# EAGLE schematic custom_ar_glasses_circuit_dlp (EAGLE 9.6.2)
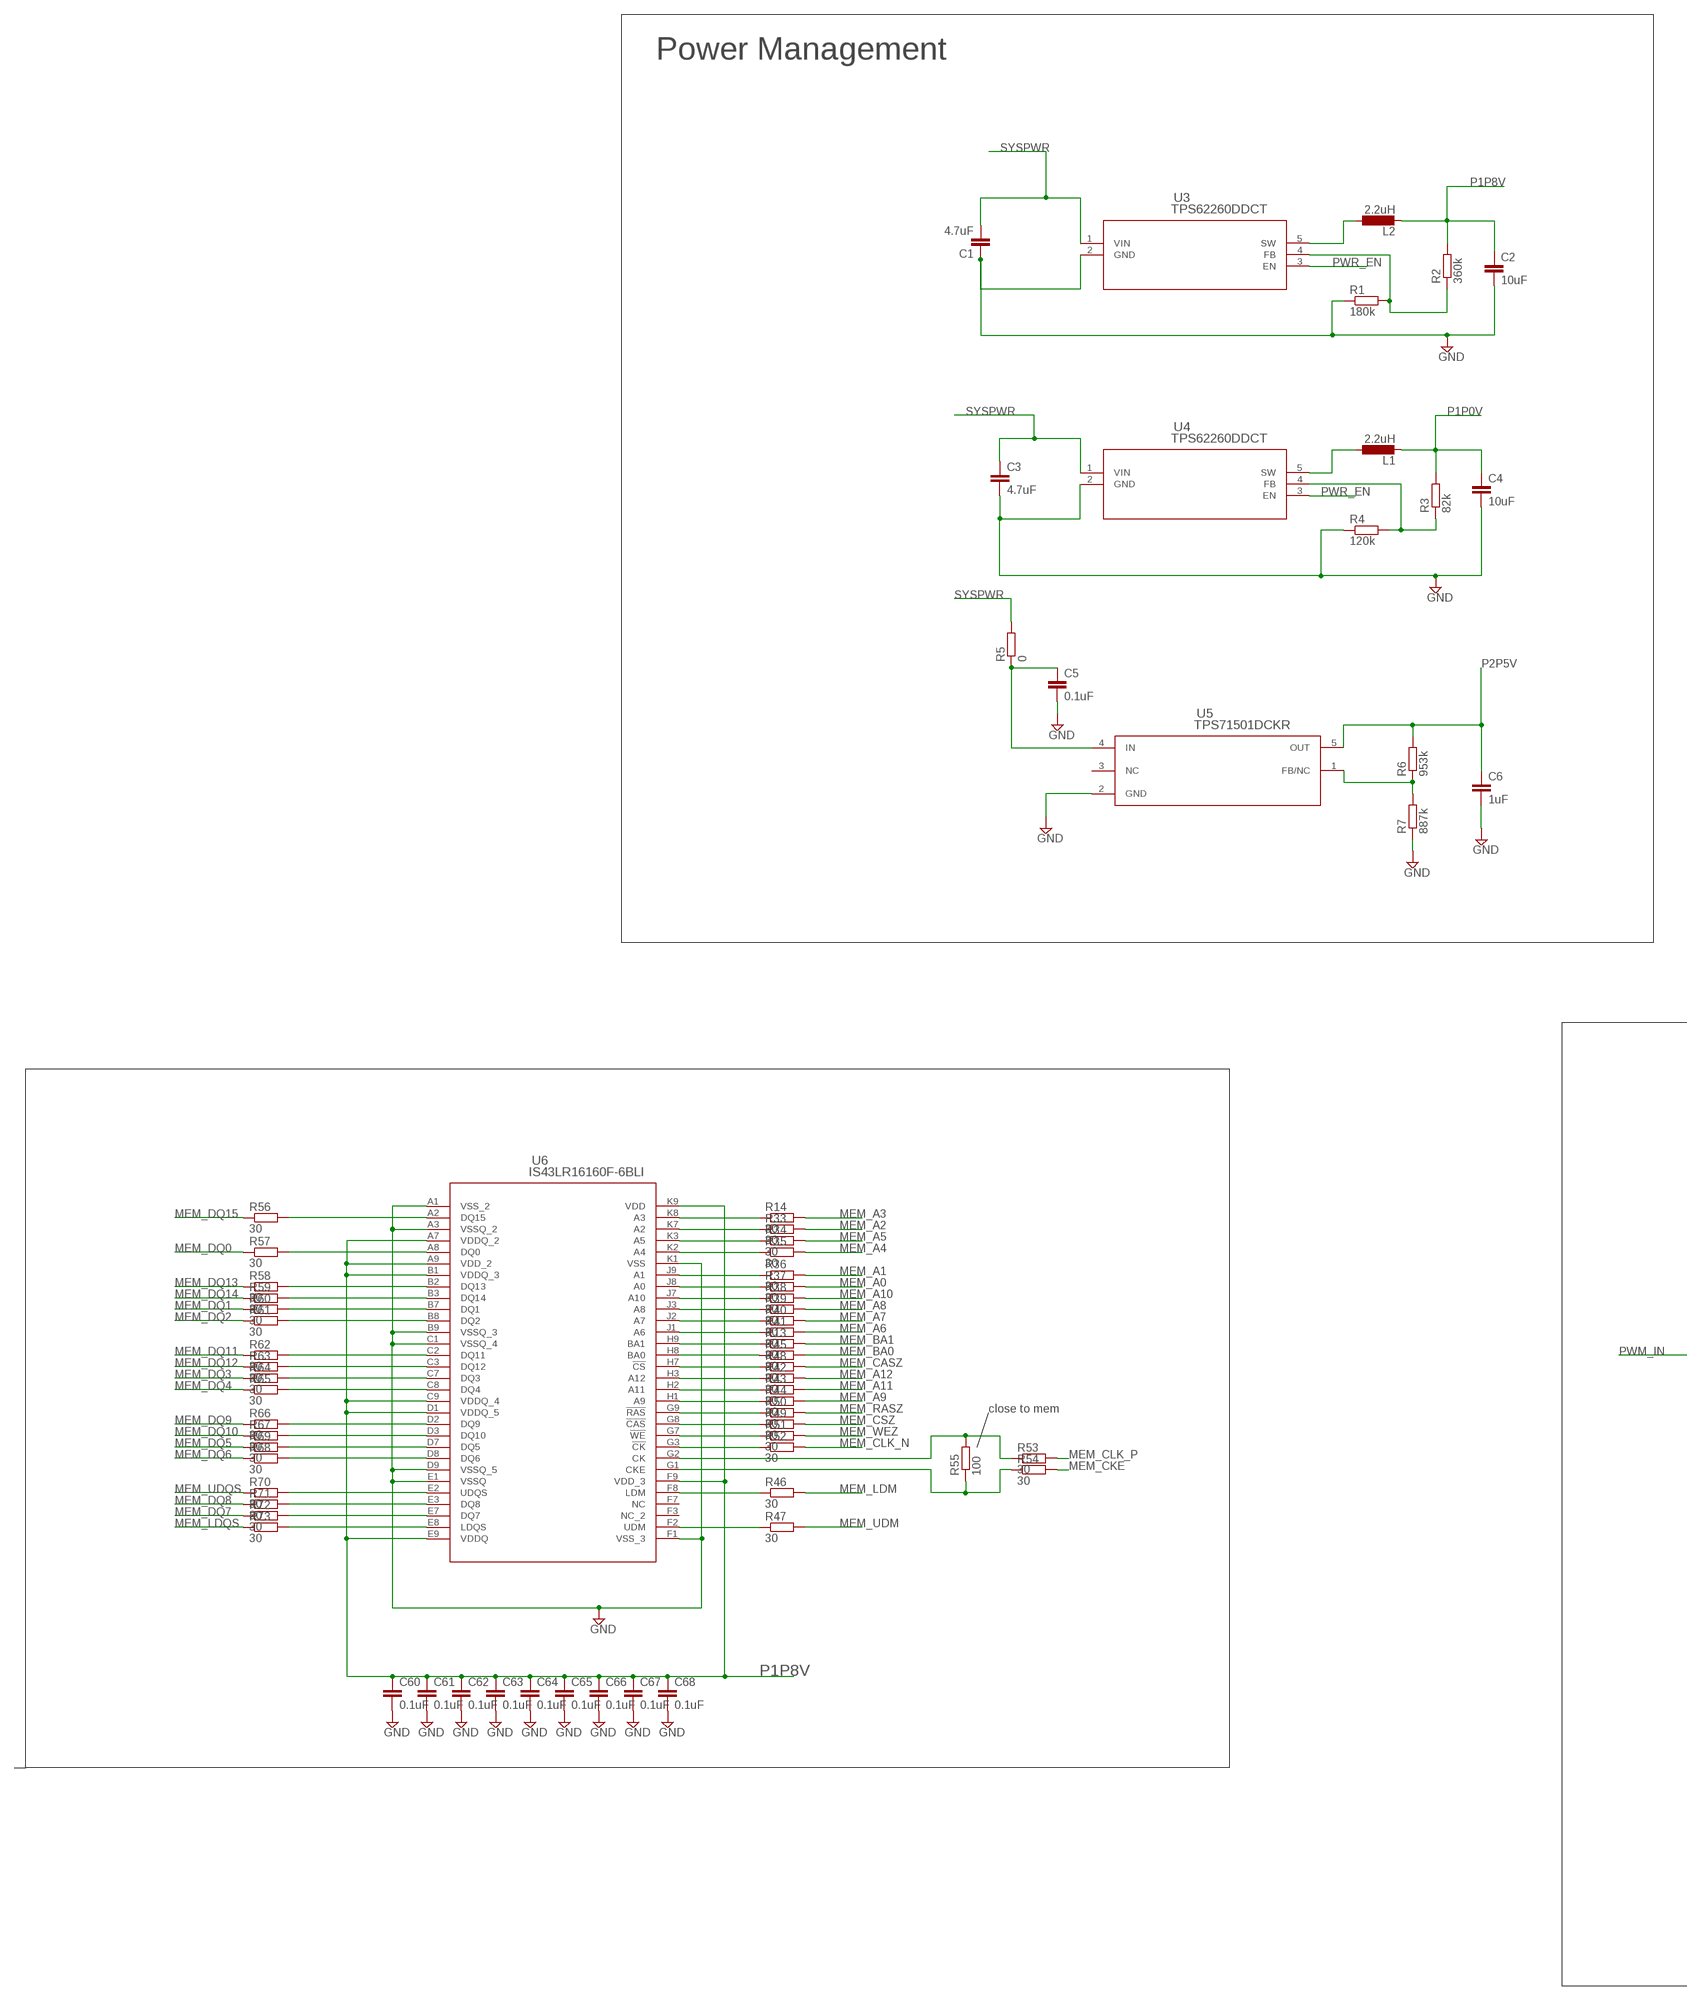
[diagram p0: schematic, sheet 1, part 1 of 3]
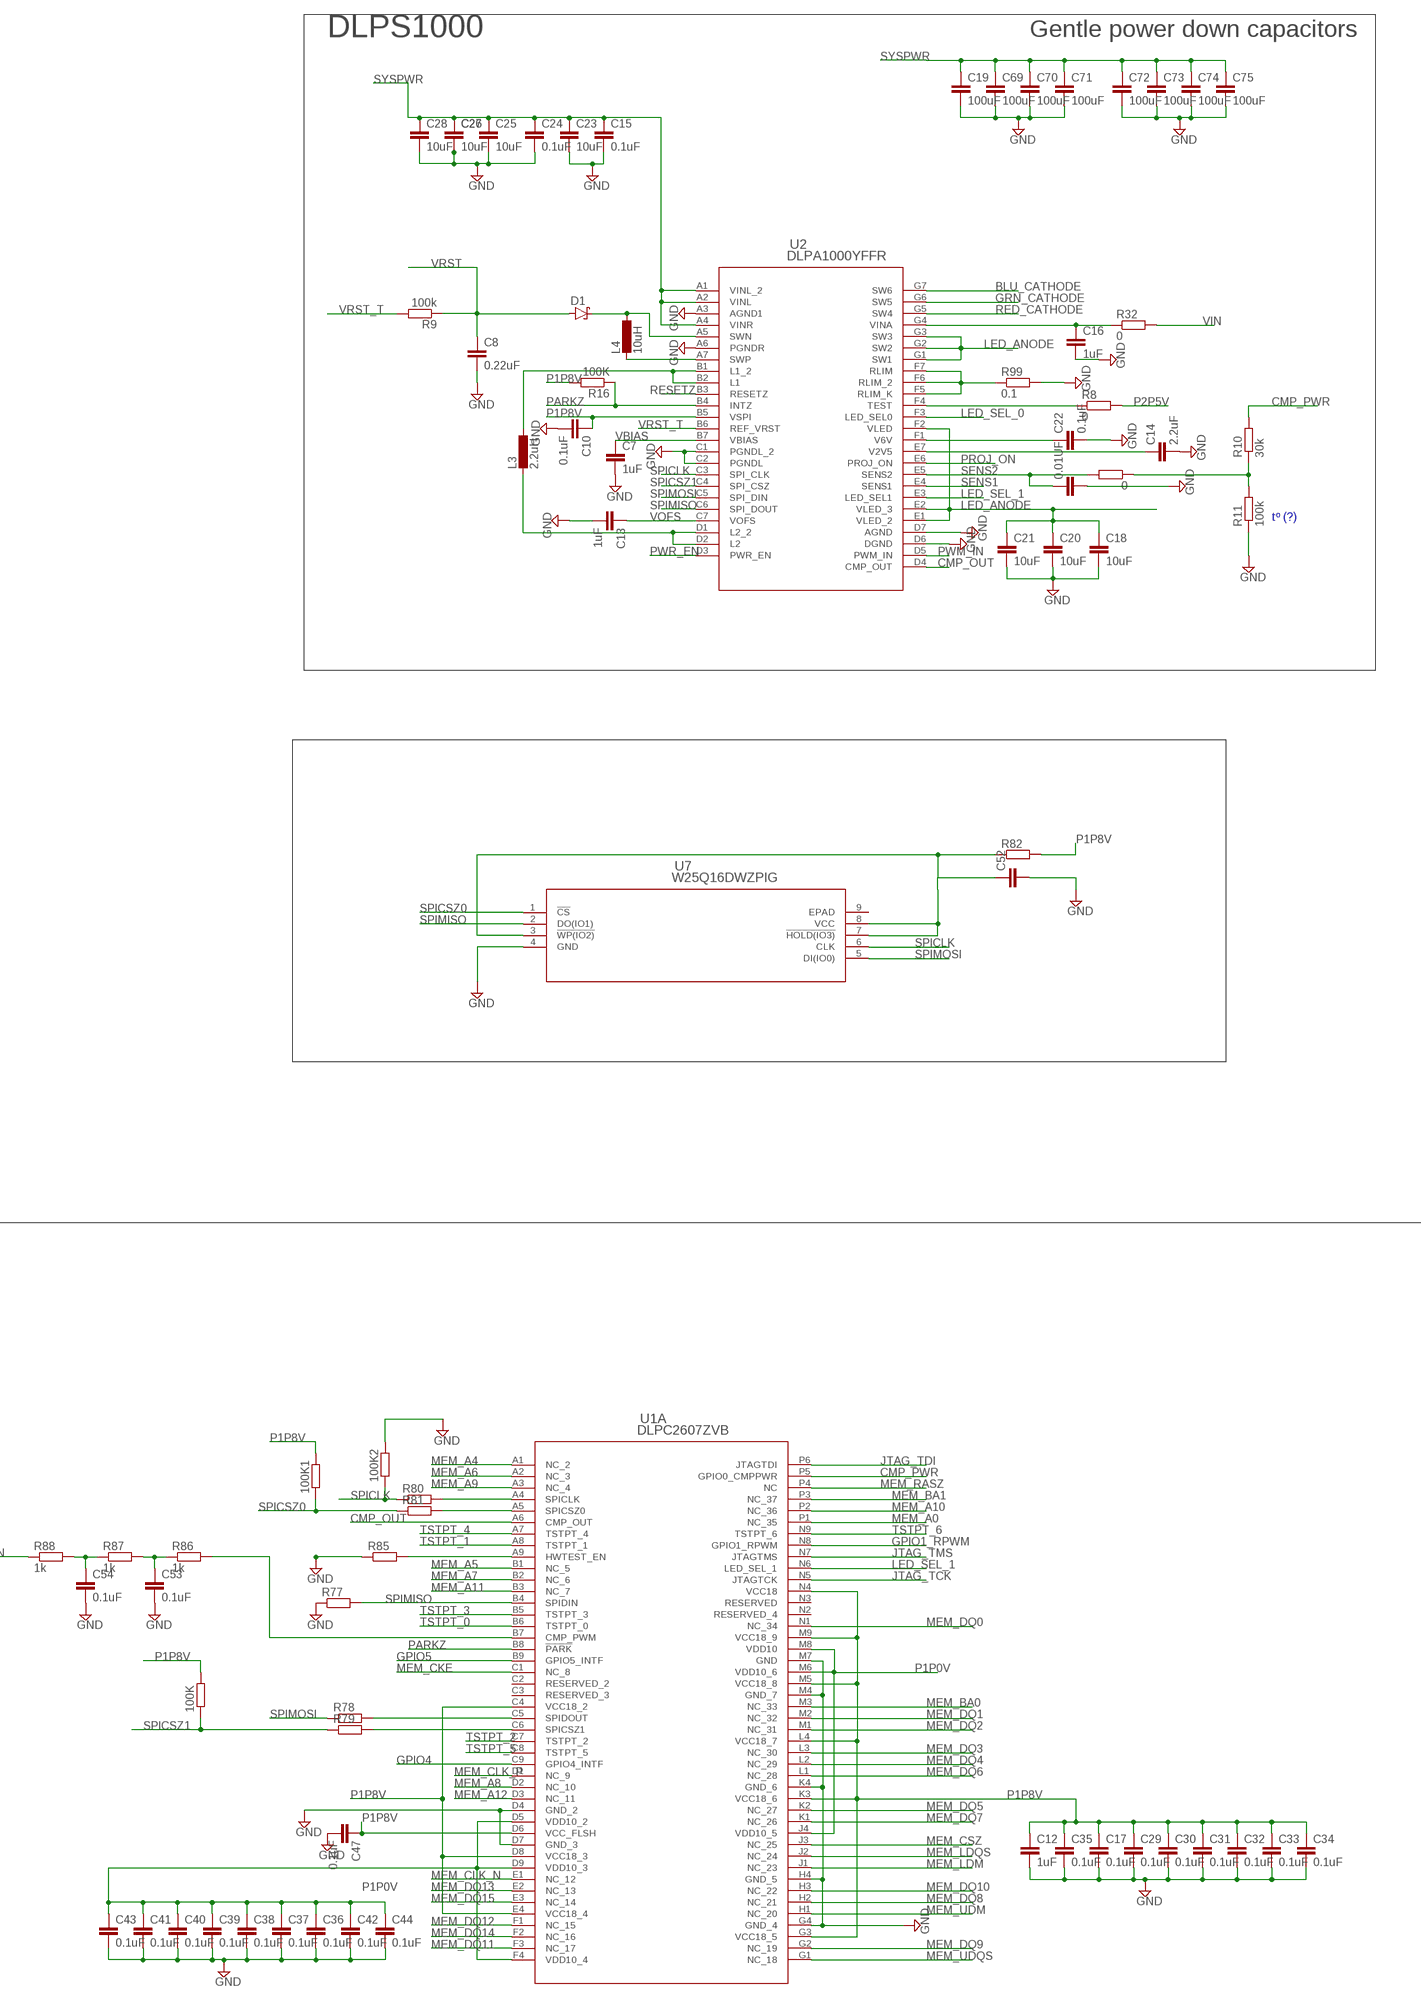
[diagram p1: schematic, sheet 1, part 2 of 3]
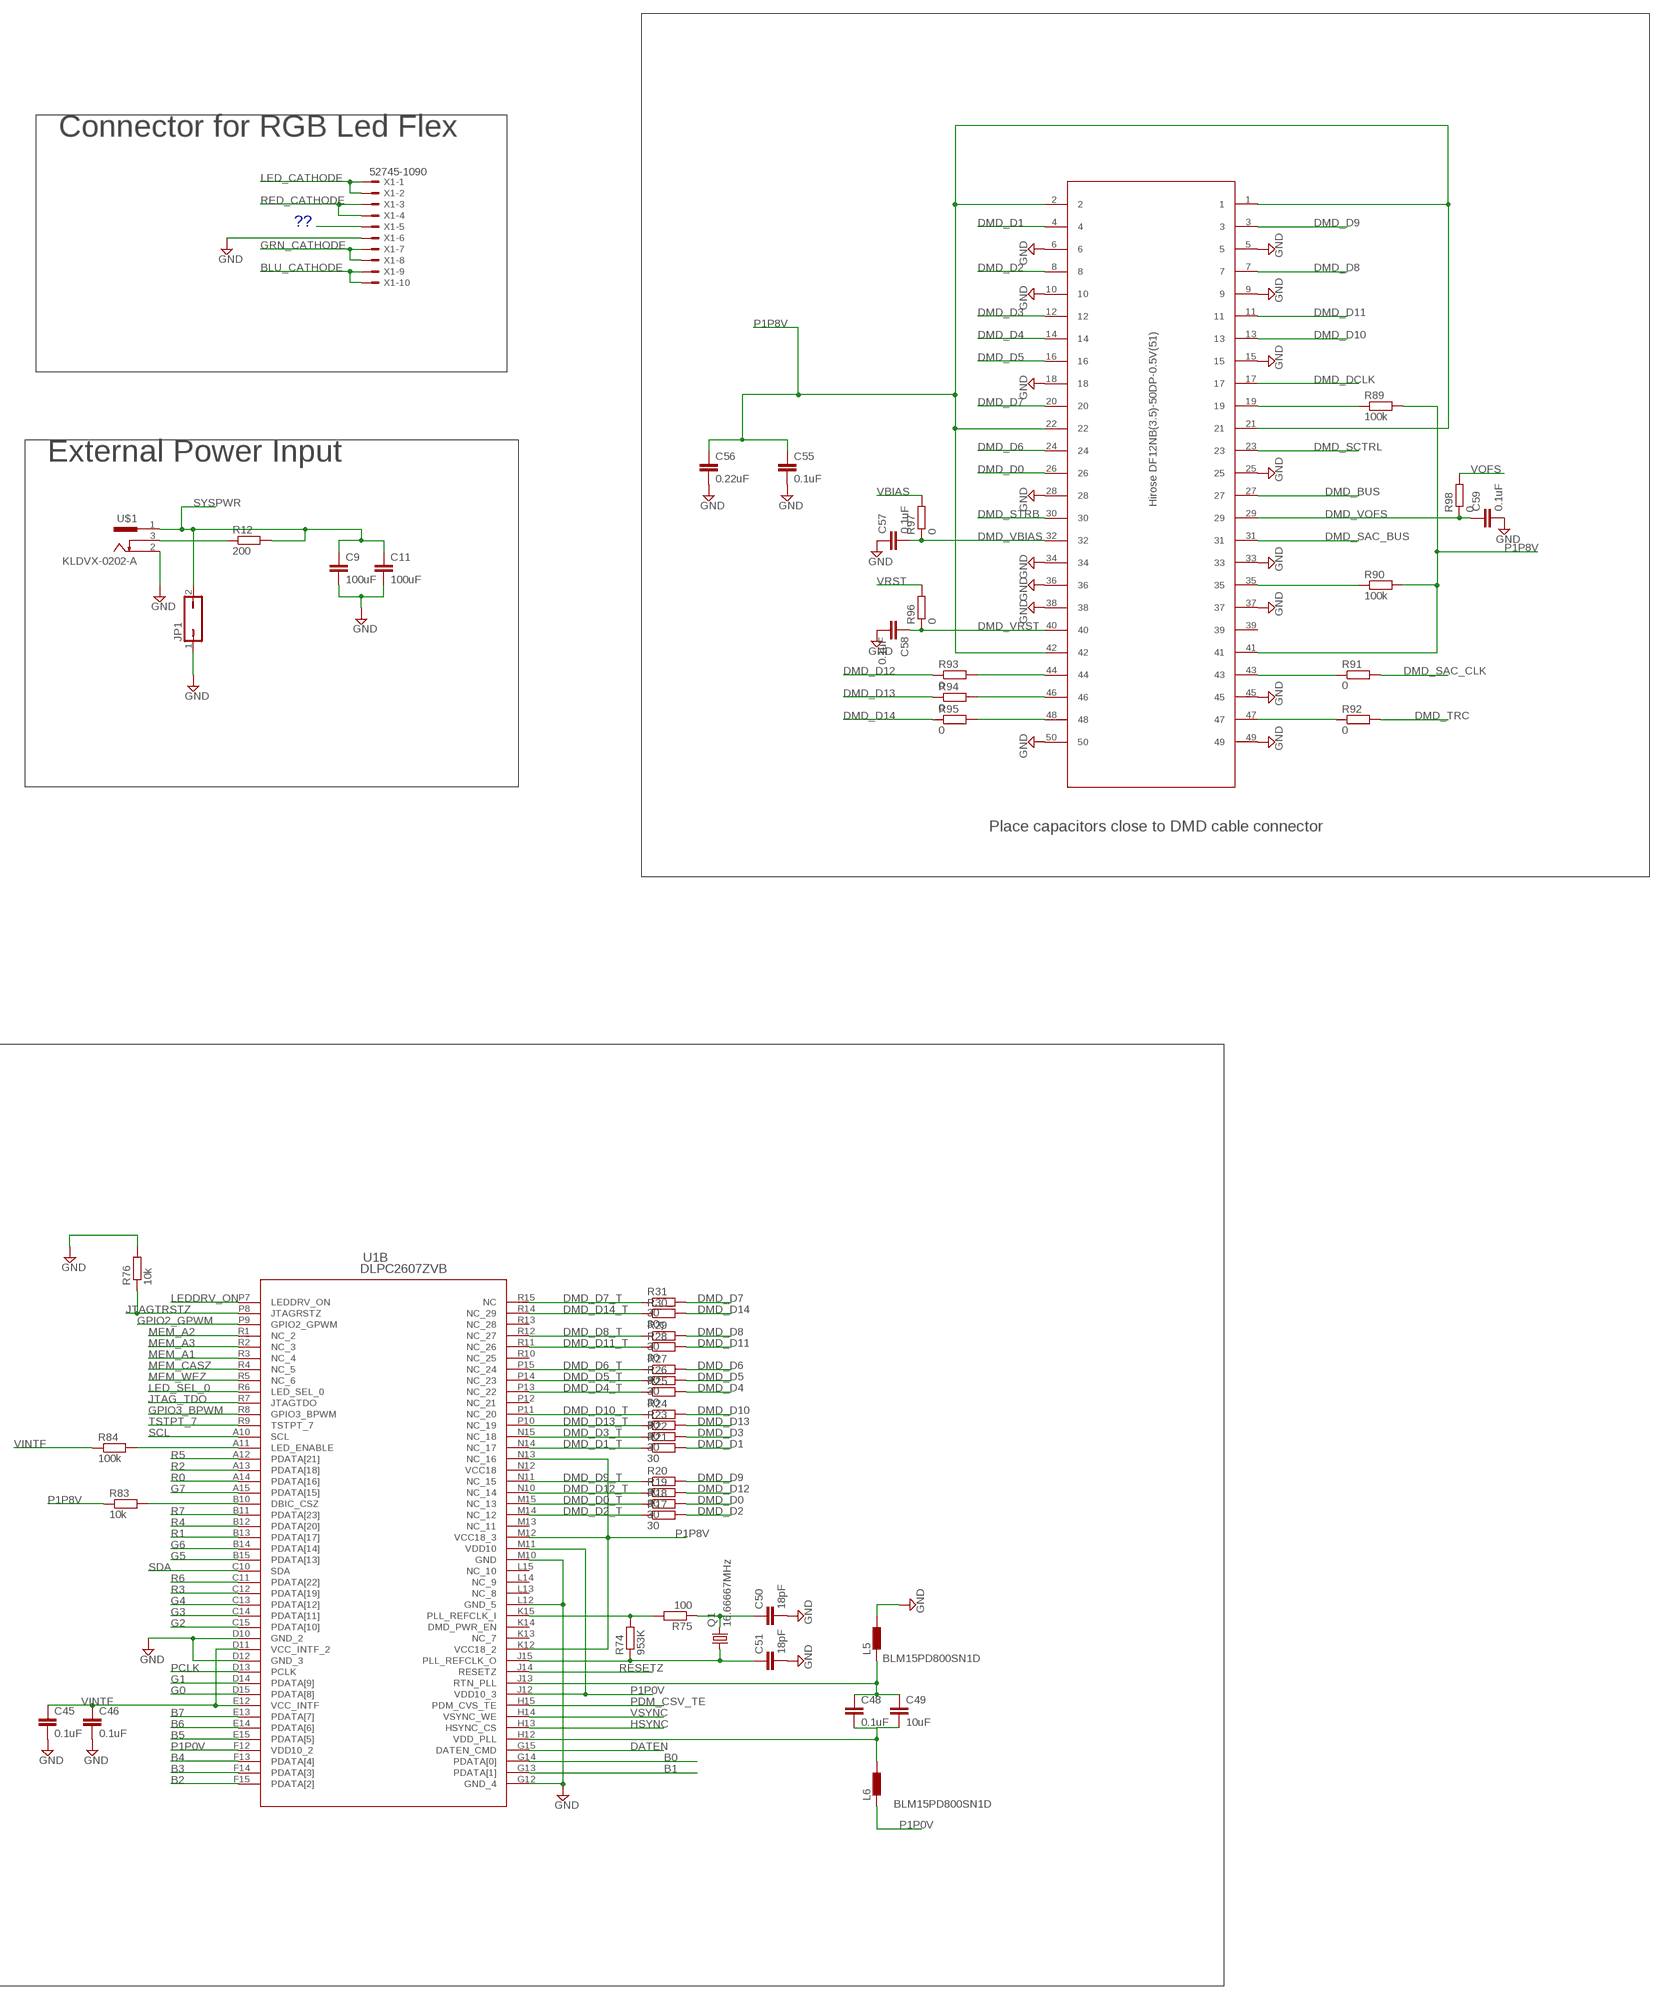
[diagram p2: schematic, sheet 1, part 3 of 3]

## Parts
0  R-EU_R0201  [R0201]
0.01UF  C-EUC0201  [C0201]
100K  R-EU_R0201  [R0201]
100K1  R-EU_R0201  [R0201]
100K2  R-EU_R0201  [R0201]
C1  4.7uF  C-EUC0201  [C0201]
C2  10uF  C-EUC0201  [C0201]
C3  4.7uF  C-EUC0201  [C0201]
C4  10uF  C-EUC0201  [C0201]
C5  0.1uF  C-EUC0201  [C0201]
C6  1uF  C-EUC0201  [C0201]
C7  1uF  C-EUC0201  [C0201]
C8  0.22uF  C-EUC0201  [C0201]
C9  100uF  C-EUC1206K  [C1206K]
C10  0.1uF  C-EUC0201  [C0201]
C11  100uF  C-EUC1206K  [C1206K]
C12  1uF  C-EUC0201  [C0201]
C13  1uF  C-EUC0201  [C0201]
C14  2.2uF  C-EUC0201  [C0201]
C15  0.1uF  C-EUC0201  [C0201]
C16  1uF  C-EUC0201  [C0201]
C17  0.1uF  C-EUC0201  [C0201]
C18  10uF  C-EUC0201  [C0201]
C19  100uF  C-EUC0805  [C0805]
C20  10uF  C-EUC0201  [C0201]
C21  10uF  C-EUC0201  [C0201]
C22  0.1uF  C-EUC0201  [C0201]
C23  10uF  C-EUC0201  [C0201]
C24  0.1uF  C-EUC0201  [C0201]
C25  10uF  C-EUC0201  [C0201]
C26  C-EUC0201  [C0201]
C27  10uF  C-EUC0201  [C0201]
C28  10uF  C-EUC0201  [C0201]
C29  0.1uF  C-EUC0201  [C0201]
C30  0.1uF  C-EUC0201  [C0201]
C31  0.1uF  C-EUC0201  [C0201]
C32  0.1uF  C-EUC0201  [C0201]
C33  0.1uF  C-EUC0201  [C0201]
C34  0.1uF  C-EUC0201  [C0201]
C35  0.1uF  C-EUC0201  [C0201]
C36  0.1uF  C-EUC0201  [C0201]
C37  0.1uF  C-EUC0201  [C0201]
C38  0.1uF  C-EUC0201  [C0201]
C39  0.1uF  C-EUC0201  [C0201]
C40  0.1uF  C-EUC0201  [C0201]
C41  0.1uF  C-EUC0201  [C0201]
C42  0.1uF  C-EUC0201  [C0201]
C43  0.1uF  C-EUC0201  [C0201]
C44  0.1uF  C-EUC0201  [C0201]
C45  0.1uF  C-EUC0201  [C0201]
C46  0.1uF  C-EUC0201  [C0201]
C47  0.1uF  C-EUC0201  [C0201]
C48  0.1uF  C-EUC0201  [C0201]
C49  10uF  C-EUC0201  [C0201]
C50  18pF  C-EUC0201  [C0201]
C51  18pF  C-EUC0201  [C0201]
C52  C-EUC0201  [C0201]
C53  0.1uF  C-EUC0201  [C0201]
C54  0.1uF  C-EUC0201  [C0201]
C55  0.1uF  C-EUC0201  [C0201]
C56  0.22uF  C-EUC0201  [C0201]
C57  0.1uF  C-EUC0201  [C0201]
C58  0.1uF  C-EUC0201  [C0201]
C59  0.1uF  C-EUC0201  [C0201]
C60  0.1uF  C-EUC0201  [C0201]
C61  0.1uF  C-EUC0201  [C0201]
C62  0.1uF  C-EUC0201  [C0201]
C63  0.1uF  C-EUC0201  [C0201]
C64  0.1uF  C-EUC0201  [C0201]
C65  0.1uF  C-EUC0201  [C0201]
C66  0.1uF  C-EUC0201  [C0201]
C67  0.1uF  C-EUC0201  [C0201]
C68  0.1uF  C-EUC0201  [C0201]
C69  100uF  C-EUC0805  [C0805]
C70  100uF  C-EUC0805  [C0805]
C71  100uF  C-EUC0805  [C0805]
C72  100uF  C-EUC0805  [C0805]
C73  100uF  C-EUC0805  [C0805]
C74  100uF  C-EUC0805  [C0805]
C75  100uF  C-EUC0805  [C0805]
D1  SCHOTTKY-DIODESMC  [SMC]
JP1  JP1Q  [JP1]
L1  2.2uH  L-EUL3225M  [L3225M]
L2  2.2uH  L-EUL3225M  [L3225M]
L3  2.2uH  L-EUL3225M  [L3225M]
L4  10uH  L-EUL3216C  [L3216C]
L5  BLM15PD800SN1D  BLM15HG601SN1  [0402]
L6  BLM15PD800SN1D  BLM15HG601SN1  [0402]
Q1  16.66667MHz  MC-405  [MC-405]
R1  180k  R-EU_R0201  [R0201]
R2  360k  R-EU_R0201  [R0201]
R3  82k  R-EU_R0201  [R0201]
R4  120k  R-EU_R0201  [R0201]
R5  0  R-EU_R0201  [R0201]
R6  953k  R-EU_R0201  [R0201]
R7  887k  R-EU_R0201  [R0201]
R8  0  R-EU_R0201  [R0201]
R9  100k  R-EU_R0201  [R0201]
R10  30k  R-EU_R0201  [R0201]
R11  100k  R-EU_R0201  [R0201]
R12  200  R-EU_R1206  [R1206]
R13  30  R-EU_R0201  [R0201]
R14  30  R-EU_R0201  [R0201]
R16  100K  R-EU_R0201  [R0201]
R17  30  R-EU_R0201  [R0201]
R18  30  R-EU_R0201  [R0201]
R19  30  R-EU_R0201  [R0201]
R20  30  R-EU_R0201  [R0201]
R21  30  R-EU_R0201  [R0201]
R22  30  R-EU_R0201  [R0201]
R23  30  R-EU_R0201  [R0201]
R24  30  R-EU_R0201  [R0201]
R25  30  R-EU_R0201  [R0201]
R26  30  R-EU_R0201  [R0201]
R27  30  R-EU_R0201  [R0201]
R28  30  R-EU_R0201  [R0201]
R29  30  R-EU_R0201  [R0201]
R30  30ç  R-EU_R0201  [R0201]
R31  30  R-EU_R0201  [R0201]
R32  0  R-EU_R0201  [R0201]
R33  30  R-EU_R0201  [R0201]
R34  30  R-EU_R0201  [R0201]
R35  30  R-EU_R0201  [R0201]
R36  30  R-EU_R0201  [R0201]
R37  30  R-EU_R0201  [R0201]
R38  30  R-EU_R0201  [R0201]
R39  30  R-EU_R0201  [R0201]
R40  30  R-EU_R0201  [R0201]
R41  30  R-EU_R0201  [R0201]
R42  30  R-EU_R0201  [R0201]
R43  30  R-EU_R0201  [R0201]
R44  30  R-EU_R0201  [R0201]
R45  30  R-EU_R0201  [R0201]
R46  30  R-EU_R0201  [R0201]
R47  30  R-EU_R0201  [R0201]
R48  30  R-EU_R0201  [R0201]
R49  30  R-EU_R0201  [R0201]
R50  30  R-EU_R0201  [R0201]
R51  30  R-EU_R0201  [R0201]
R52  30  R-EU_R0201  [R0201]
R53  30  R-EU_R0201  [R0201]
R54  30  R-EU_R0201  [R0201]
R55  100  R-EU_R0201  [R0201]
R56  30  R-EU_R0201  [R0201]
R57  30  R-EU_R0201  [R0201]
R58  30  R-EU_R0201  [R0201]
R59  30  R-EU_R0201  [R0201]
R60  30  R-EU_R0201  [R0201]
R61  30  R-EU_R0201  [R0201]
R62  30  R-EU_R0201  [R0201]
R63  30  R-EU_R0201  [R0201]
R64  30  R-EU_R0201  [R0201]
R65  30  R-EU_R0201  [R0201]
R66  30  R-EU_R0201  [R0201]
R67  30  R-EU_R0201  [R0201]
R68  30  R-EU_R0201  [R0201]
R69  30  R-EU_R0201  [R0201]
R70  30  R-EU_R0201  [R0201]
R71  30  R-EU_R0201  [R0201]
R72  30  R-EU_R0201  [R0201]
R73  30  R-EU_R0201  [R0201]
R74  953K  R-EU_R0201  [R0201]
R75  100  R-EU_R0201  [R0201]
R76  10k  R-EU_R0201  [R0201]
R77  R-EU_R0201  [R0201]
R78  R-EU_R0201  [R0201]
R79  R-EU_R0201  [R0201]
R80  R-EU_R0201  [R0201]
R81  R-EU_R0201  [R0201]
R82  R-EU_R0201  [R0201]
R83  10k  R-EU_R0201  [R0201]
R84  100k  R-EU_R0201  [R0201]
R85  R-EU_R0201  [R0201]
R86  1k  R-EU_R0201  [R0201]
R87  1k  R-EU_R0201  [R0201]
R88  1k  R-EU_R0201  [R0201]
R89  100k  R-EU_R0201  [R0201]
R90  100k  R-EU_R0201  [R0201]
R91  0  R-EU_R0201  [R0201]
R92  0  R-EU_R0201  [R0201]
R93  0  R-EU_R0201  [R0201]
R94  0  R-EU_R0201  [R0201]
R95  0  R-EU_R0201  [R0201]
R96  0  R-EU_R0201  [R0201]
R97  0  R-EU_R0201  [R0201]
R98  0  R-EU_R0201  [R0201]
R99  0.1  R-EU_R0201  [R0201]
U1  DLPC2607ZVB  [ZVB176_TEX]
U2  DLPA1000YFFR  [YFF49_TEX]
U3  TPS62260DDCT  [DDC5]
U4  TPS62260DDCT  [DDC5]
U5  TPS71501DCKR  [DCK5]
U6  IS43LR16160F-6BLI  [TFBGA-60_8X10_ISI]
U7  W25Q16DWZPIG  [WIN_ZP-8_WIN]
U$1  KLDVX-0202-A  [KLDVX-0202-A]
U$2  HIROSEDF12NB(3.5)-50DP-0.5V(51)  [HIROSEDF12NB(3.5)-50DP-0.5V(51)]
X1  52745-1090  [52745-1090]

## Nets
B0: U1.G14(B:PDATA[0])
B1: U1.G13(B:PDATA[1])
B2: U1.F15(B:PDATA[2])
B3: U1.F14(B:PDATA[3])
B4: U1.F13(B:PDATA[4])
B5: U1.E15(B:PDATA[5])
B6: U1.E14(B:PDATA[6])
B7: U1.E13(B:PDATA[7])
BLU_CATHODE: U2.G7(SW6) X1.9 X1.10
CMP_OUT: U1.A6(A:CMP_OUT) U2.D4(CMP_OUT)
CMP_PWR: R10.2 U1.P5(A:GPIO0_CMPPWR)
DATEN: U1.G15(B:DATEN_CMD)
DMD_BUS: U$2.27
DMD_D0: R18.2 U$2.26
DMD_D0_T: R18.1 U1.M15(B:NC_13)
DMD_D1: R21.2 U$2.4
DMD_D1_T: R21.1 U1.N14(B:NC_17)
DMD_D2: R17.2 U$2.8
DMD_D2_T: R17.1 U1.M14(B:NC_12)
DMD_D3: R22.2 U$2.12
DMD_D3_T: R22.1 U1.N15(B:NC_18)
DMD_D4: R25.2 U$2.14
DMD_D4_T: R25.1 U1.P13(B:NC_22)
DMD_D5: R26.2 U$2.16
DMD_D5_T: R26.1 U1.P14(B:NC_23)
DMD_D6: R27.2 U$2.24
DMD_D6_T: R27.1 U1.P15(B:NC_24)
DMD_D7: R31.2 U$2.20
DMD_D7_T: R31.1 U1.R15(B:NC)
DMD_D8: R29.2 U$2.7
DMD_D8_T: R29.1 U1.R12(B:NC_27)
DMD_D9: R20.2 U$2.3
DMD_D9_T: R20.1 U1.N11(B:NC_15)
DMD_D10: R24.2 U$2.13
DMD_D10_T: R24.1 U1.P11(B:NC_20)
DMD_D11: R28.2 U$2.11
DMD_D11_T: R28.1 U1.R11(B:NC_26)
DMD_D12: R19.2 R93.1
DMD_D12_T: R19.1 U1.N10(B:NC_14)
DMD_D13: R23.2 R94.1
DMD_D13_T: R23.1 U1.P10(B:NC_19)
DMD_D14: R30.2 R95.1
DMD_D14_T: R30.1 U1.R14(B:NC_29)
DMD_DCLK: U$2.17
DMD_SAC_BUS: U$2.31
DMD_SAC_CLK: R91.2
DMD_SCTRL: U$2.23
DMD_STRB: U$2.30
DMD_TRC: R92.2
DMD_VBIAS: C57.2 R97.1 U$2.32
DMD_VOFS: C59.1 R98.1 U$2.29
DMD_VRST: C58.1 R96.1 U$2.40
G0: U1.D15(B:PDATA[8])
G1: U1.D14(B:PDATA[9])
G2: U1.C15(B:PDATA[10])
G3: U1.C14(B:PDATA[11])
G4: U1.C13(B:PDATA[12])
G5: U1.B15(B:PDATA[13])
G6: U1.B14(B:PDATA[14])
G7: U1.A15(B:PDATA[15])
GND: 0.01UF.2 100K2.2 C1.1 C2.2 C3.2 C4.2 C5.2 C6.2 C7.2 C8.2 C9.2 C10.2 C11.2 C12.2 C13.2 C14.2 C15.2 C16.2 C17.2 C18.2 C19.2 C20.2 C21.2 C22.2 C23.2 C24.2 C25.2 C26.2 C27.2 C28.2 C29.2 C30.2 C31.2 C32.2 C33.2 C34.2 C35.2 C36.2 C37.2 C38.2 C39.2 C40.2 C41.2 C42.2 C43.2 C44.2 C45.2 C46.2 C47.2 C50.2 C51.2 C52.2 C53.2 C54.2 C55.2 C56.2 C57.1 C58.2 C59.2 C60.2 C61.2 C62.2 C63.2 C64.2 C65.2 C66.2 C67.2 C68.2 C69.2 C70.2 C71.2 C72.2 C73.2 C74.2 C75.2 JP1.1 L5.2 R1.1 R4.1 R7.1 R11.1 R76.2 R77.1 R85.1 R99.2 U1.D4(A:GND_2) U1.D7(A:GND_3) U1.D10(B:GND_2) U1.D12(B:GND_3) U1.G4(A:GND_4) U1.G12(B:GND_4) U1.H4(A:GND_5) U1.K4(A:GND_6) U1.L12(B:GND_5) U1.M4(A:GND_7) U1.M7(A:GND) U1.M10(B:GND) U2.A3(AGND1) U2.A6(PGNDR) U2.C1(PGNDL_2) U2.C2(PGNDL) U2.D6(DGND) U2.D7(AGND) U3.2(GND) U4.2(GND) U5.2(GND) U6.A1(VSS_2) U6.A3(VSSQ_2) U6.B9(VSSQ_3) U6.C1(VSSQ_4) U6.D9(VSSQ_5) U6.E1(VSSQ) U6.F1(VSS_3) U6.K1(VSS) U7.4(GND) U$1.2 U$2.5 U$2.6 U$2.9 U$2.10 U$2.15 U$2.18 U$2.25 U$2.28 U$2.33 U$2.34 U$2.36 U$2.37 U$2.38 U$2.45 U$2.49 U$2.50 X1.6
GPIO1_RPWM: U1.N8(A:GPIO1_RPWM)
GPIO2_GPWM: U1.P9(B:GPIO2_GPWM)
GPIO3_BPWM: U1.R8(B:GPIO3_BPWM)
GPIO4: U1.C9(A:GPIO4_INTF)
GPIO5: U1.B9(A:GPIO5_INTF)
GRN_CATHODE: U2.G6(SW5) X1.7 X1.8
HSYNC: U1.H13(B:HSYNC_CS)
JTAG_TCK: U1.N5(A:JTAGTCK)
JTAG_TDI: U1.P6(A:JTAGTDI)
JTAG_TDO: U1.R7(B:JTAGTDO)
JTAG_TMS: U1.N7(A:JTAGTMS)
JTAGTRSTZ: R76.1 U1.P8(B:JTAGRSTZ)
LED_ANODE: C18.1 C20.1 C21.1 U2.E1(VLED_2) U2.E2(VLED_3) U2.F2(VLED) U2.G1(SW1) U2.G2(SW2) U2.G3(SW3)
LED_CATHODE: X1.1 X1.2
LED_SEL_0: U1.R6(B:LED_SEL_0) U2.F3(LED_SEL0)
LED_SEL_1: U1.N6(A:LED_SEL_1) U2.E3(LED_SEL1)
LEDDRV_ON: U1.P7(B:LEDDRV_ON)
MEM_A0: R37.2 U1.P1(A:NC_35)
MEM_A1: R36.2 U1.R3(B:NC_4)
MEM_A2: R33.2 U1.R1(B:NC_2)
MEM_A3: R14.2 U1.R2(B:NC_3)
MEM_A4: R35.2 U1.A1(A:NC_2)
MEM_A5: R34.2 U1.B1(A:NC_5)
MEM_A6: R41.2 U1.A2(A:NC_3)
MEM_A7: R40.2 U1.B2(A:NC_6)
MEM_A8: R39.2 U1.D2(A:NC_10)
MEM_A9: R44.2 U1.A3(A:NC_4)
MEM_A10: R38.2 U1.P2(A:NC_36)
MEM_A11: R43.2 U1.B3(A:NC_7)
MEM_A12: R42.2 U1.D3(A:NC_11)
MEM_BA0: R45.2 U1.M3(A:NC_33)
MEM_BA1: R13.2 U1.P3(A:NC_37)
MEM_CASZ: R48.2 U1.R4(B:NC_5)
MEM_CKE: R54.2 U1.C1(A:NC_8)
MEM_CLK_N: R52.2 U1.E1(A:NC_12)
MEM_CLK_P: R53.2 U1.D1(A:NC_9)
MEM_CSZ: R49.2 U1.J3(A:NC_25)
MEM_DQ0: R57.1 U1.N1(A:NC_34)
MEM_DQ1: R60.1 U1.M2(A:NC_32)
MEM_DQ2: R61.1 U1.M1(A:NC_31)
MEM_DQ3: R64.1 U1.L3(A:NC_30)
MEM_DQ4: R65.1 U1.L2(A:NC_29)
MEM_DQ5: R69.1 U1.K2(A:NC_27)
MEM_DQ6: R68.1 U1.L1(A:NC_28)
MEM_DQ7: R72.1 U1.K1(A:NC_26)
MEM_DQ8: R71.1 U1.H2(A:NC_21)
MEM_DQ9: R66.1 U1.G2(A:NC_19)
MEM_DQ10: R67.1 U1.H3(A:NC_22)
MEM_DQ11: R62.1 U1.F3(A:NC_17)
MEM_DQ12: R63.1 U1.F1(A:NC_15)
MEM_DQ13: R58.1 U1.E2(A:NC_13)
MEM_DQ14: R59.1 U1.F2(A:NC_16)
MEM_DQ15: R56.1 U1.E3(A:NC_14)
MEM_LDM: R46.2 U1.J1(A:NC_23)
MEM_LDQS: R73.1 U1.J2(A:NC_24)
MEM_RASZ: R50.2 U1.P4(A:NC)
MEM_UDM: R47.2 U1.H1(A:NC_20)
MEM_UDQS: R70.1 U1.G1(A:NC_18)
MEM_WEZ: R51.2 U1.R5(B:NC_6)
N$1: R1.2 R2.1 U3.4(FB)
N$2: C22.1 U2.F1(V6V)
N$3: L2.1 U3.5(SW)
N$4: R8.1 U2.F4(TEST)
N$5: L1.1 U4.5(SW)
N$6: R99.1 U2.F5(RLIM_K) U2.F6(RLIM_2) U2.F7(RLIM)
N$7: R3.1 R4.2 U4.4(FB)
N$8: C5.1 R5.1 U5.4(IN)
N$9: C14.1 U2.E7(V2V5)
N$10: R6.1 R7.2 U5.1(FB/NC)
N$12: L4.2 U2.A7(SWP)
N$13: D1.C L4.1 U2.A5(SWN)
N$15: R36.1 U6.J9(A1)
N$16: 0.1 R10.1 R11.2
N$17: R12.1 U$1.3
N$18: C16.1 R32.1 U2.G4(VINA)
N$19: R35.1 U6.K2(A4)
N$20: X1.5
N$21: C48.1 C49.1 L5.1 U1.J13(B:RTN_PLL)
N$22: C48.2 C49.2 L6.2 U1.H12(B:VDD_PLL)
N$23: R14.1 U6.K8(A3)
N$24: R13.1 U6.H9(BA1)
N$25: R34.1 U6.K3(A5)
N$26: R33.1 U6.K7(A2)
N$27: L3.1 U2.B1(L1_2) U2.B2(L1)
N$28: L3.2 U2.D1(L2_2) U2.D2(L2)
N$29: R40.1 U6.J2(A7)
N$30: R39.1 U6.J3(A8)
N$31: R38.1 U6.J7(A10)
N$32: R43.1 U6.H2(A11)
N$33: R37.1 U6.J8(A0)
N$34: R41.1 U6.J1(A6)
N$35: R42.1 U6.H3(A12)
N$36: R44.1 U6.H1(A9)
N$37: R45.1 U6.H8(BA0)
N$38: R46.1 U6.F8(LDM)
N$39: R47.1 U6.F2(UDM)
N$40: R49.1 U6.G8(!CAS)
N$41: R48.1 U6.H7(!CS)
N$42: R50.1 U6.G9(!RAS)
N$43: R51.1 U6.G7(!WE)
N$44: R52.1 U6.G3(!CK)
N$45: R53.1 R55.2 U6.G2(CK)
N$46: R54.1 R55.1 U6.G1(CKE)
N$49: R74.2 R75.2 U1.K15(B:PLL_REFCLK_I)
N$50: C51.1 Q1.1 R74.1 U1.J15(B:PLL_REFCLK_O)
N$53: C50.1 Q1.2 R75.1
N$54: R78.2 U1.C5(A:SPIDOUT)
N$55: R79.2 U1.C6(A:SPICSZ1)
N$56: R80.2 U1.A4(A:SPICLK)
N$57: R56.2 U6.A2(DQ15)
N$58: R57.2 U6.A8(DQ0)
N$59: R58.2 U6.B2(DQ13)
N$60: R59.2 U6.B3(DQ14)
N$61: R60.2 U6.B7(DQ1)
N$62: R61.2 U6.B8(DQ2)
N$63: R62.2 U6.C2(DQ11)
N$64: R63.2 U6.C3(DQ12)
N$65: R64.2 U6.C7(DQ3)
N$66: R65.2 U6.C8(DQ4)
N$67: R66.2 U6.D2(DQ9)
N$68: R67.2 U6.D3(DQ10)
N$69: R69.2 U6.D7(DQ5)
N$70: R68.2 U6.D8(DQ6)
N$71: R71.2 U6.E3(DQ8)
N$72: R72.2 U6.E7(DQ7)
N$73: R70.2 U6.E2(UDQS)
N$74: R73.2 U6.E8(LDQS)
N$75: R81.2 U1.A5(A:SPICSZ0)
N$76: R84.2 U1.A11(B:LED_ENABLE)
N$77: R85.2 U1.A9(A:HWTEST_EN)
N$78: C52.1 R82.1 U7.3(!WP(IO2)) U7.7(!HOLD(IO3)) U7.8(VCC)
N$79: R83.2 U1.B10(B:DBIC_CSZ)
N$80: R86.2 U1.B7(A:CMP_PWM)
N$81: C54.1 R87.1 R88.2
N$82: C53.1 R86.1 R87.2
N$83: R90.1 U$2.35
N$84: R89.1 U$2.19
N$85: R91.1 U$2.43
N$86: R92.1 U$2.47
N$90: R93.2 U$2.44
N$91: R94.2 U$2.46
N$92: R95.2 U$2.48
P1P0V: C4.1 C36.1 C37.1 C38.1 C39.1 C40.1 C41.1 C42.1 C43.1 C44.1 L1.2 L6.1 R3.2 U1.D5(A:VDD10_2) U1.D9(A:VDD10_3) U1.F4(A:VDD10_4) U1.F12(B:VDD10_2) U1.J4(A:VDD10_5) U1.J12(B:VDD10_3) U1.M6(A:VDD10_6) U1.M8(A:VDD10) U1.M11(B:VDD10)
P1P8V: 100K1.2 100K.2 C2.1 C10.1 C12.1 C17.1 C29.1 C30.1 C31.1 C32.1 C33.1 C34.1 C35.1 C47.1 C55.1 C56.1 C60.1 C61.1 C62.1 C63.1 C64.1 C65.1 C66.1 C67.1 C68.1 L2.2 R2.2 R16.2 R82.2 R83.1 R89.2 R90.2 U1.C4(A:VCC18_2) U1.D6(A:VCC_FLSH) U1.D8(A:VCC18_3) U1.E4(A:VCC18_4) U1.G3(A:VCC18_5) U1.K3(A:VCC18_6) U1.K12(B:VCC18_2) U1.L4(A:VCC18_7) U1.M5(A:VCC18_8) U1.M9(A:VCC18_9) U1.M12(B:VCC18_3) U1.N4(A:VCC18) U1.N13(B:NC_16) U2.B5(VSPI) U6.A7(VDDQ_2) U6.A9(VDD_2) U6.B1(VDDQ_3) U6.C9(VDDQ_4) U6.D1(VDDQ_5) U6.E9(VDDQ) U6.F9(VDD_3) U6.K9(VDD) U$2.1 U$2.2 U$2.21 U$2.22 U$2.41 U$2.42
P2P5V: C6.1 R6.2 R8.2 U5.5(OUT)
PARKZ: R16.1 U1.B8(A:!PARK) U2.B4(INTZ)
PCLK: U1.D13(B:PCLK)
PDM_CSV_TE: U1.H15(B:PDM_CVS_TE)
PROJ_ON: U2.E6(PROJ_ON)
PWM_IN: R88.1 U2.D5(PWM_IN)
PWR_EN: U2.D3(PWR_EN) U3.3(EN) U4.3(EN)
R0: U1.A14(B:PDATA[16])
R1: U1.B13(B:PDATA[17])
R2: U1.A13(B:PDATA[18])
R3: U1.C12(B:PDATA[19])
R4: U1.B12(B:PDATA[20])
R5: U1.A12(B:PDATA[21])
R6: U1.C11(B:PDATA[22])
R7: U1.B11(B:PDATA[23])
RED_CATHODE: U2.G5(SW4) X1.3 X1.4
RESETZ: U1.J14(B:RESETZ) U2.B3(RESETZ)
SCL: U1.A10(B:SCL)
SDA: U1.C10(B:SDA)
SENS1: U2.E4(SENS1)
SENS2: 0.01UF.1 0.2 U2.E5(SENS2)
SPICLK: 100K2.1 R80.1 U2.C3(SPI_CLK) U7.6(CLK)
SPICSZ0: 100K1.1 R81.1 U7.1(!CS)
SPICSZ1: 100K.1 R79.1 U2.C4(SPI_CSZ)
SPIMISO: R77.2 U1.B4(A:SPIDIN) U2.C6(SPI_DOUT) U7.2(DO(IO1))
SPIMOSI: R78.1 U2.C5(SPI_DIN) U7.5(DI(IO0))
SYSPWR: C1.2 C3.1 C9.1 C11.1 C15.1 C19.1 C23.1 C24.1 C25.1 C26.1 C27.1 C28.1 C69.1 C70.1 C71.1 C72.1 C73.1 C74.1 C75.1 JP1.2 R5.2 R12.2 U2.A1(VINL_2) U2.A2(VINL) U2.A4(VINR) U3.1(VIN) U4.1(VIN) U$1.1
TSTPT_0: U1.B6(A:TSTPT_0)
TSTPT_1: U1.A8(A:TSTPT_1)
TSTPT_2: U1.C7(A:TSTPT_2)
TSTPT_3: U1.B5(A:TSTPT_3)
TSTPT_4: U1.A7(A:TSTPT_4)
TSTPT_5: U1.C8(A:TSTPT_5)
TSTPT_6: U1.N9(A:TSTPT_6)
TSTPT_7: U1.R9(B:TSTPT_7)
VBIAS: C7.1 R97.2 U2.B7(VBIAS)
VIN: R32.2
VINTF: C45.1 C46.1 R84.1 U1.D11(B:VCC_INTF_2) U1.E12(B:VCC_INTF)
VOFS: C13.1 R98.2 U2.C7(VOFS)
VRST: C8.1 D1.A R9.1 R96.2
VRST_T: R9.2 U2.B6(REF_VRST)
VSYNC: U1.H14(B:VSYNC_WE)
Unconnected: U1.C2(A:RESERVED_2) U1.C3(A:RESERVED_3) U1.K13(B:NC_7) U1.K14(B:DMD_PWR_EN) U1.L13(B:NC_8) U1.L14(B:NC_9) U1.L15(B:NC_10) U1.M13(B:NC_11) U1.N2(A:RESERVED_4) U1.N3(A:RESERVED) U1.P12(B:NC_21) U1.R10(B:NC_25) U1.R13(B:NC_28) U5.3(NC) U6.F3(NC_2) U6.F7(NC) U7.9(EPAD) U$1.1@1 U$1.2@1 U$1.3@1 U$2.39

## Notes on the sheet
- DLPS1000 | Gentle power down capacitors
- Power Management
- Connector for RGB Led Flex
- ??
- tº (?)
- External Power Input
- Place capacitors close to DMD cable connector
- close to mem

## Power pins joined to a net without a drawn wire
VCC18: U1.N12(B:VCC18)

## Library data of the parts
0 100K 100K1 100K2 R1-R14 R16-R99 = rcl:R-EU_: RESISTOR, European symbol; SPICEPREFIX: R
0.01UF C1-C75 = rcl:C-EU: CAPACITOR, European symbol; SPICEPREFIX: C
D1 = diode:SCHOTTKY-DIODE: Schottky Diode
JP1 = jumper:JP1Q: JUMPER
L1-L4 = rcl:L-EU: INDUCTOR, European symbol; SPICEPREFIX: L
L5 L6 = inductors:BLM15H: EMIFIL (R) Chip Ferrite Bead for GHz Noise Source: http://www.murata.com/ Ferrite Bead BLM15H.pdf
Q1 = crystal:MC-405: kHz RANGE CRYSTAL UNIT SMD Source: MC-306_405_406_E07X.PDF Homepage <http://www.epsontoyocom.co.jp>; OC_FARNELL: unknown; OC_NEWARK: unknown
U1 = DLPC2607:DLPC2607ZVB; BUILT_BY: EMA_UL_Team; MANUFACTURER_PART_NUMBER: DLPC2607ZVB; SOURCELIBRARY: TI_2016-08-12; VENDOR: Texas Instruments
U2 = DLP_TI:DLPA1000YFFR; BUILT_BY: EMA_Jessica; COPYRIGHT: Copyright (C) 2018 Accelerated Designs. All rights reserved; MANUFACTURER_PART_NUMBER: DLPA1000YFFR; SOURCELIBRARY: TI_2019-05-10; VENDOR: Texas Instruments
U3 U4 = DLP_TI:TPS62260DDCT; COPYRIGHT: Copyright (C) 2021 Ultra Librarian. All rights reserved.; MANUFACTURER_PART_NUMBER: TPS62260DDCT; MFR_NAME: Texas Instruments
U5 = DLP_TI:TPS71501DCKR; COPYRIGHT: Copyright (C) 2021 Ultra Librarian. All rights reserved.; MANUFACTURER_PART_NUMBER: TPS71501DCKR; MFR_NAME: Texas Instruments
U6 = DLP_TI:IS43LR16160F-6BLI; COPYRIGHT: Copyright (C) 2021 Ultra Librarian. All rights reserved.; MANUFACTURER_PART_NUMBER: IS43LR16160F-6BLI; MFR_NAME: ISSI
U7 = DLP_TI:W25Q16DWZPIG; COPYRIGHT: Copyright (C) 2021 Ultra Librarian. All rights reserved.; MANUFACTURER_PART_NUMBER: W25Q16DWZPIG; MFR_NAME: Winbond
U$1 = con-kycon:KLDVX-0202-: Power Jack, Vertical, PCB Mount, 2.0 mm, 2.5 mm, 3.0 mm Center Pin Source: KLDVX-0202x.pdf; OC_FARNELL: unknown; OC_NEWARK: unknown
U$2 = DLP_TI:HIROSEDF12NB(3.5)-50DP-0.5V(51)
X1 = con-molex:52745-1090: FFC/FPC-to-Board 0.50mm (.020") SMT Top Contact Right Angle, ZIF, Style Receptacle 52745 / 52435 Source: http://www.molex.com/product/ffc/52745.html; MF: MOLEX; MPN: 52745-1090; OC_FARNELL: unknown; OC_NEWARK: 92M6380